# Altium project led_heart.PrjPCB
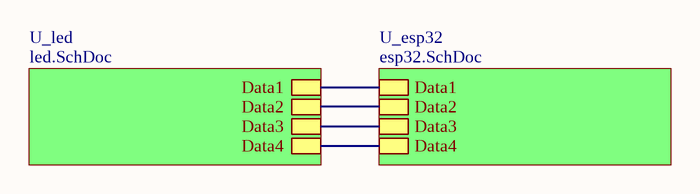
[diagram p0: sche.SchDoc]
3 sheets, 105 parts. Net scope: hierarchical (ports join the sheet entries above them; power ports are global).
Board file: PCB_led_hearrt.PcbDoc
Sheets:
  sche.SchDoc
    U_esp32 = esp32.SchDoc
    U_led = led.SchDoc

## Sheet sche.SchDoc
size A

### Sub-sheets
U_esp32 = esp32.SchDoc: Data1, Data2, Data3, Data4
U_led = led.SchDoc: Data1, Data2, Data3, Data4

### Nets
NetU1_8: sheet U_esp32/Data4, sheet U_led/Data4
NetU1_10: sheet U_esp32/Data3, sheet U_led/Data3
NetU1_11: sheet U_esp32/Data2, sheet U_led/Data2
NetU1_12: sheet U_esp32/Data1, sheet U_led/Data1

## Sheet esp32.SchDoc
size A4
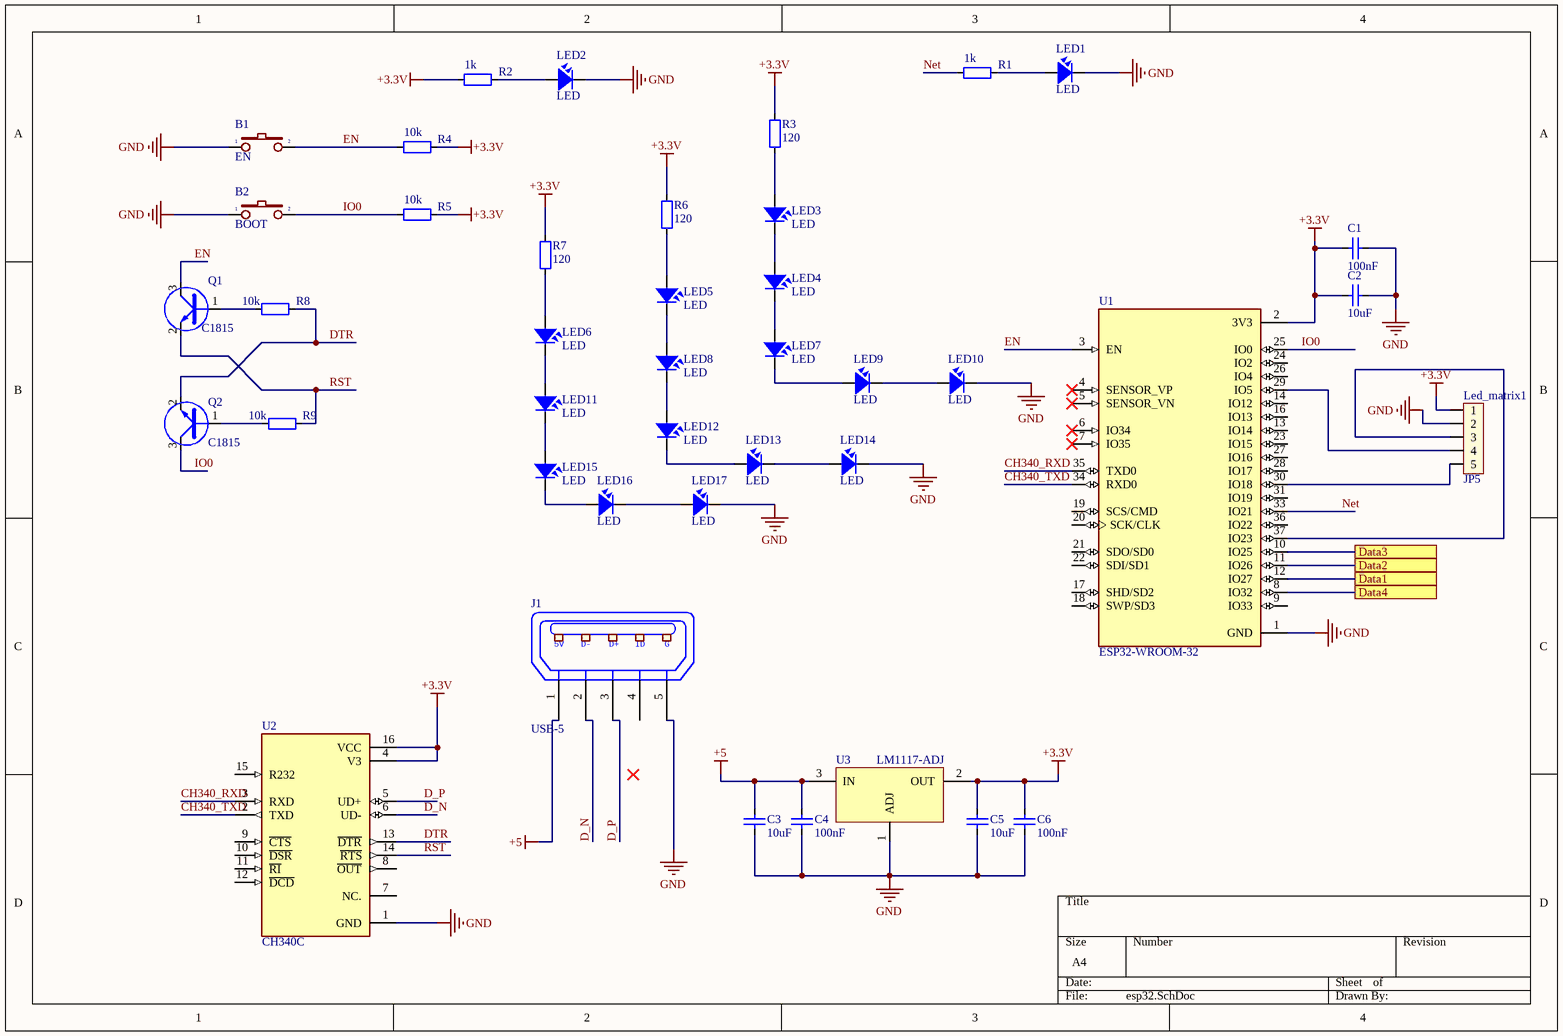
[diagram p1: esp32.SchDoc]

### Parts
B1  EN  [BUTTON_2_SMD]
B2  BOOT  [BUTTON_2_SMD]
C1  100nF  [CAP_0805]
C2  10uF  [CAP_0805]
C3  10uF  [CAP_0805]
C4  100nF  [CAP_0805]
C5  10uF  [CAP_0805]
C6  100nF  [CAP_0805]
J1  USB-5  [USB-M1]
LED1  LED  [LED-0805-Red]
LED2  LED  [LED-0805-Red]
LED3  LED  [LED-0805-Red]
LED4  LED  [LED-0805-Red]
LED5  LED  [LED-0805-Red]
LED6  LED  [LED-0805-Red]
LED7  LED  [LED-0805-Red]
LED8  LED  [LED-0805-Red]
LED9  LED  [LED-0805-Red]
LED10  LED  [LED-0805-Red]
LED11  LED  [LED-0805-Red]
LED12  LED  [LED-0805-Red]
LED13  LED  [LED-0805-Red]
LED14  LED  [LED-0805-Red]
LED15  LED  [LED-0805-Red]
LED16  LED  [LED-0805-Red]
LED17  LED  [LED-0805-Red]
Led_matrix1  JP5  [JP5H]
Q1  C1815  [SOT23]
Q2  C1815  [SOT23]
R1  1k  [RES-SMD-0805]
R2  1k  [RES-SMD-0805]
R3  120  [RES-SMD-0805]
R4  10k  [RES-SMD-0805]
R5  10k  [RES-SMD-0805]
R6  120  [RES-SMD-0805]
R7  120  [RES-SMD-0805]
R8  10k  [RES-SMD-0805]
R9  10k  [RES-SMD-0805]
U1  ESP32-WROOM-32  [ESP32_WROOM32E]
U2  CH340C  [SOIC127P600X180-16N]
U3  LM1117-ADJ  [LM1117-SOP]

### Ports
Data1, Data2, Data3, Data4

### Nets
+3.3V: C1.1 C2.1 C5.1 C6.1 Led_matrix1.1 R2.2 R3.1 R4.1 R5.1 R6.1 R7.1 U1.2(3V3) U2.4(V3) U2.16(VCC) U3.2(OUT)
+5: C3.1 C4.1 J1.1(P1) U3.3(IN)
GND: B1.1 B2.1 C1.2 C2.2 C3.2 C4.2 C5.2 C6.2 J1.5(P5) LED1.2 LED2.2 LED10.2 LED14.2 LED17.2 Led_matrix1.2 U1.1(GND) U2.1(GND) U3.1(ADJ)
CH340_RXD: U1.35(TXD0) U2.3(RXD)
CH340_TXD: U1.34(RXD0) U2.2(TXD)
D_N: J1.2(P2) U2.6(UD-)
D_P: J1.3(P3) U2.5(UD+)
DTR: Q2.2(E) R8.1 U2.13(~{DTR})
EN: B1.2 Q1.3(C) R4.2 U1.3(EN)
IO0: B2.2 Q2.3(C) R5.2 U1.25(IO0)
Net: R1.2 U1.33(IO21)
RST: Q1.2(E) R9.1 U2.14(~{RTS})
NetLED1_1: LED1.1 R1.1
NetLED2_1: LED2.1 R2.1
NetLED3_1: LED3.1 R3.2
NetLED3_2: LED3.2 LED4.1
NetLED4_2: LED4.2 LED7.1
NetLED5_1: LED5.1 R6.2
NetLED5_2: LED5.2 LED8.1
NetLED6_1: LED6.1 R7.2
NetLED6_2: LED6.2 LED11.1
NetLED7_2: LED7.2 LED9.1
NetLED8_2: LED8.2 LED12.1
NetLED9_2: LED9.2 LED10.1
NetLED11_2: LED11.2 LED15.1
NetLED12_2: LED12.2 LED13.1
NetLED13_2: LED13.2 LED14.1
NetLED15_2: LED15.2 LED16.1
NetLED16_2: LED16.2 LED17.1
NetLed_matrix1_3: Led_matrix1.3 U1.37(IO23)
NetLed_matrix1_4: Led_matrix1.4 U1.29(IO5)
NetLed_matrix1_5: Led_matrix1.5 U1.30(IO18)
NetQ1_1: Q1.1(B) R8.2
NetQ2_1: Q2.1(B) R9.2
NetU1_8: U1.8(IO32) ; port Data4
NetU1_10: U1.10(IO25) ; port Data3
NetU1_11: U1.11(IO26) ; port Data2
NetU1_12: U1.12(IO27) ; port Data1

Not connected (* = marked no-connect by the designer): J1 4(P4); U1 4(SENSOR_VP)* 5(SENSOR_VN)* 6(IO34)* 7(IO35)* 9(IO33) 13(IO14) 14(IO12) 16(IO13) 17(SHD/SD2) 18(SWP/SD3) 19(SCS/CMD) 20(SCK/CLK) 21(SDO/SD0) 22(SDI/SD1) 23(IO15) 24(IO2) 26(IO4) 27(IO16) 28(IO17) 31(IO19) 36(IO22); U2 7(NC.) 8(~{OUT}) 9(~{CTS}) 10(~{DSR}) 11(~{RI}) 12(~{DCD}) 15(R232)

### Notes on the sheet
- (in symbol USB-5) 5V; D-; D+; ID; G

### Library data of the parts
B1 B2 = Button 3x4x2.5
C1-C6 = CapSMD: Capacitor; Value: 33p; Published: 8-Jun-2000; LatestRevisionDate: 17-Jul-2002; LatestRevisionNote: Re-released for DXP Platform.; PackageReference: RAD-0.3; Publisher: Altium Limited
J1 = USB-5: Manufacturer: FCI; Manufacturer Part Number: 10118193-0001LF; Connector Type: USB - micro B; Number of Contacts: 5; Gender: Receptacle; Specifications: USB 2.0; .Creator: MM; .Checked PCB: RF; Supplier 1: Digi-Key; RoHS: RoHS Compliant; Category: Connectors, Interconnects; Stock 1: 28642; Pricing 1: 1=0.46, 10=0.433, 25=0.3712, 50=0.3156, 100=0.3032, 250=0.27224, 500=0.25988 (USD); Packaging: Cut Tape (CT); Mounting Type: Surface Mount, Right Angle, Horizontal; Features: Shielded, Solder Retention; Ingress Protection: -; ComponentLink1URL: http://portal.fciconnect.com/Comergent//fci/drawing/10118193.pdf; ComponentLink1Description: http://portal.fciconnect.com/Comergent//fci/drawing/10118193.pdf; Supplier Part Number 1: 609-4616-1-ND; .Checked SCH: MM
LED1-LED17 = LED: LED Single colour Green and Red; Value: LED 3 ly Single Colour
Q1 Q2 = 2SC1815: NPN 600mW, ECB; Value: C1815
R1-R9 = Resistor - SMD: Resistor; Manufacturer: Generic Components; Class: Passive; Published: 08/06/2000; Publisher: Altium Hobart Technology Centre
U1 = ESP32-WROOM-32: Bluetooth, WiFi Transceiver Module 2.4GHz ~ 2.5GHz Surface Mount; MF: Espressif Systems; Package: Module Espressif Systems; Digi-Key_Part_Number: 1904-1010-1-ND; Digi-Key_Purchase_URL: https://www.digikey.com/product-detail/en/espressif-systems/ESP32-WROOM-32/1904-1010-1-ND/8544305?utm_source=snapeda&utm_medium=aggregator&utm_campaign=symbol; Value: *; MP: ESP32-WROOM-32; SnapEDA_Link: https://www.snapeda.com/parts/ESP32-WROOM-32/Espressif%20Systems/view-part/2753322/?ref=snap
U2 = CH340C: USB to serial chip CH340; MF: WCH; Price: None; Availability: Not in stock; MP: CH340C; Package: None; SnapEDA_Link: https://www.snapeda.com/parts/CH340C/WCH/view-part/?ref=snap; Check_prices: https://www.snapeda.com/parts/CH340C/WCH/view-part/?ref=eda; Value: *
U3 = LM1117-ADJ: 800mA Low-Dropout Linear Regulator; Creator: Nguyen Ba Bien; Website: http://group3i.net

## Sheet led.SchDoc
size A3
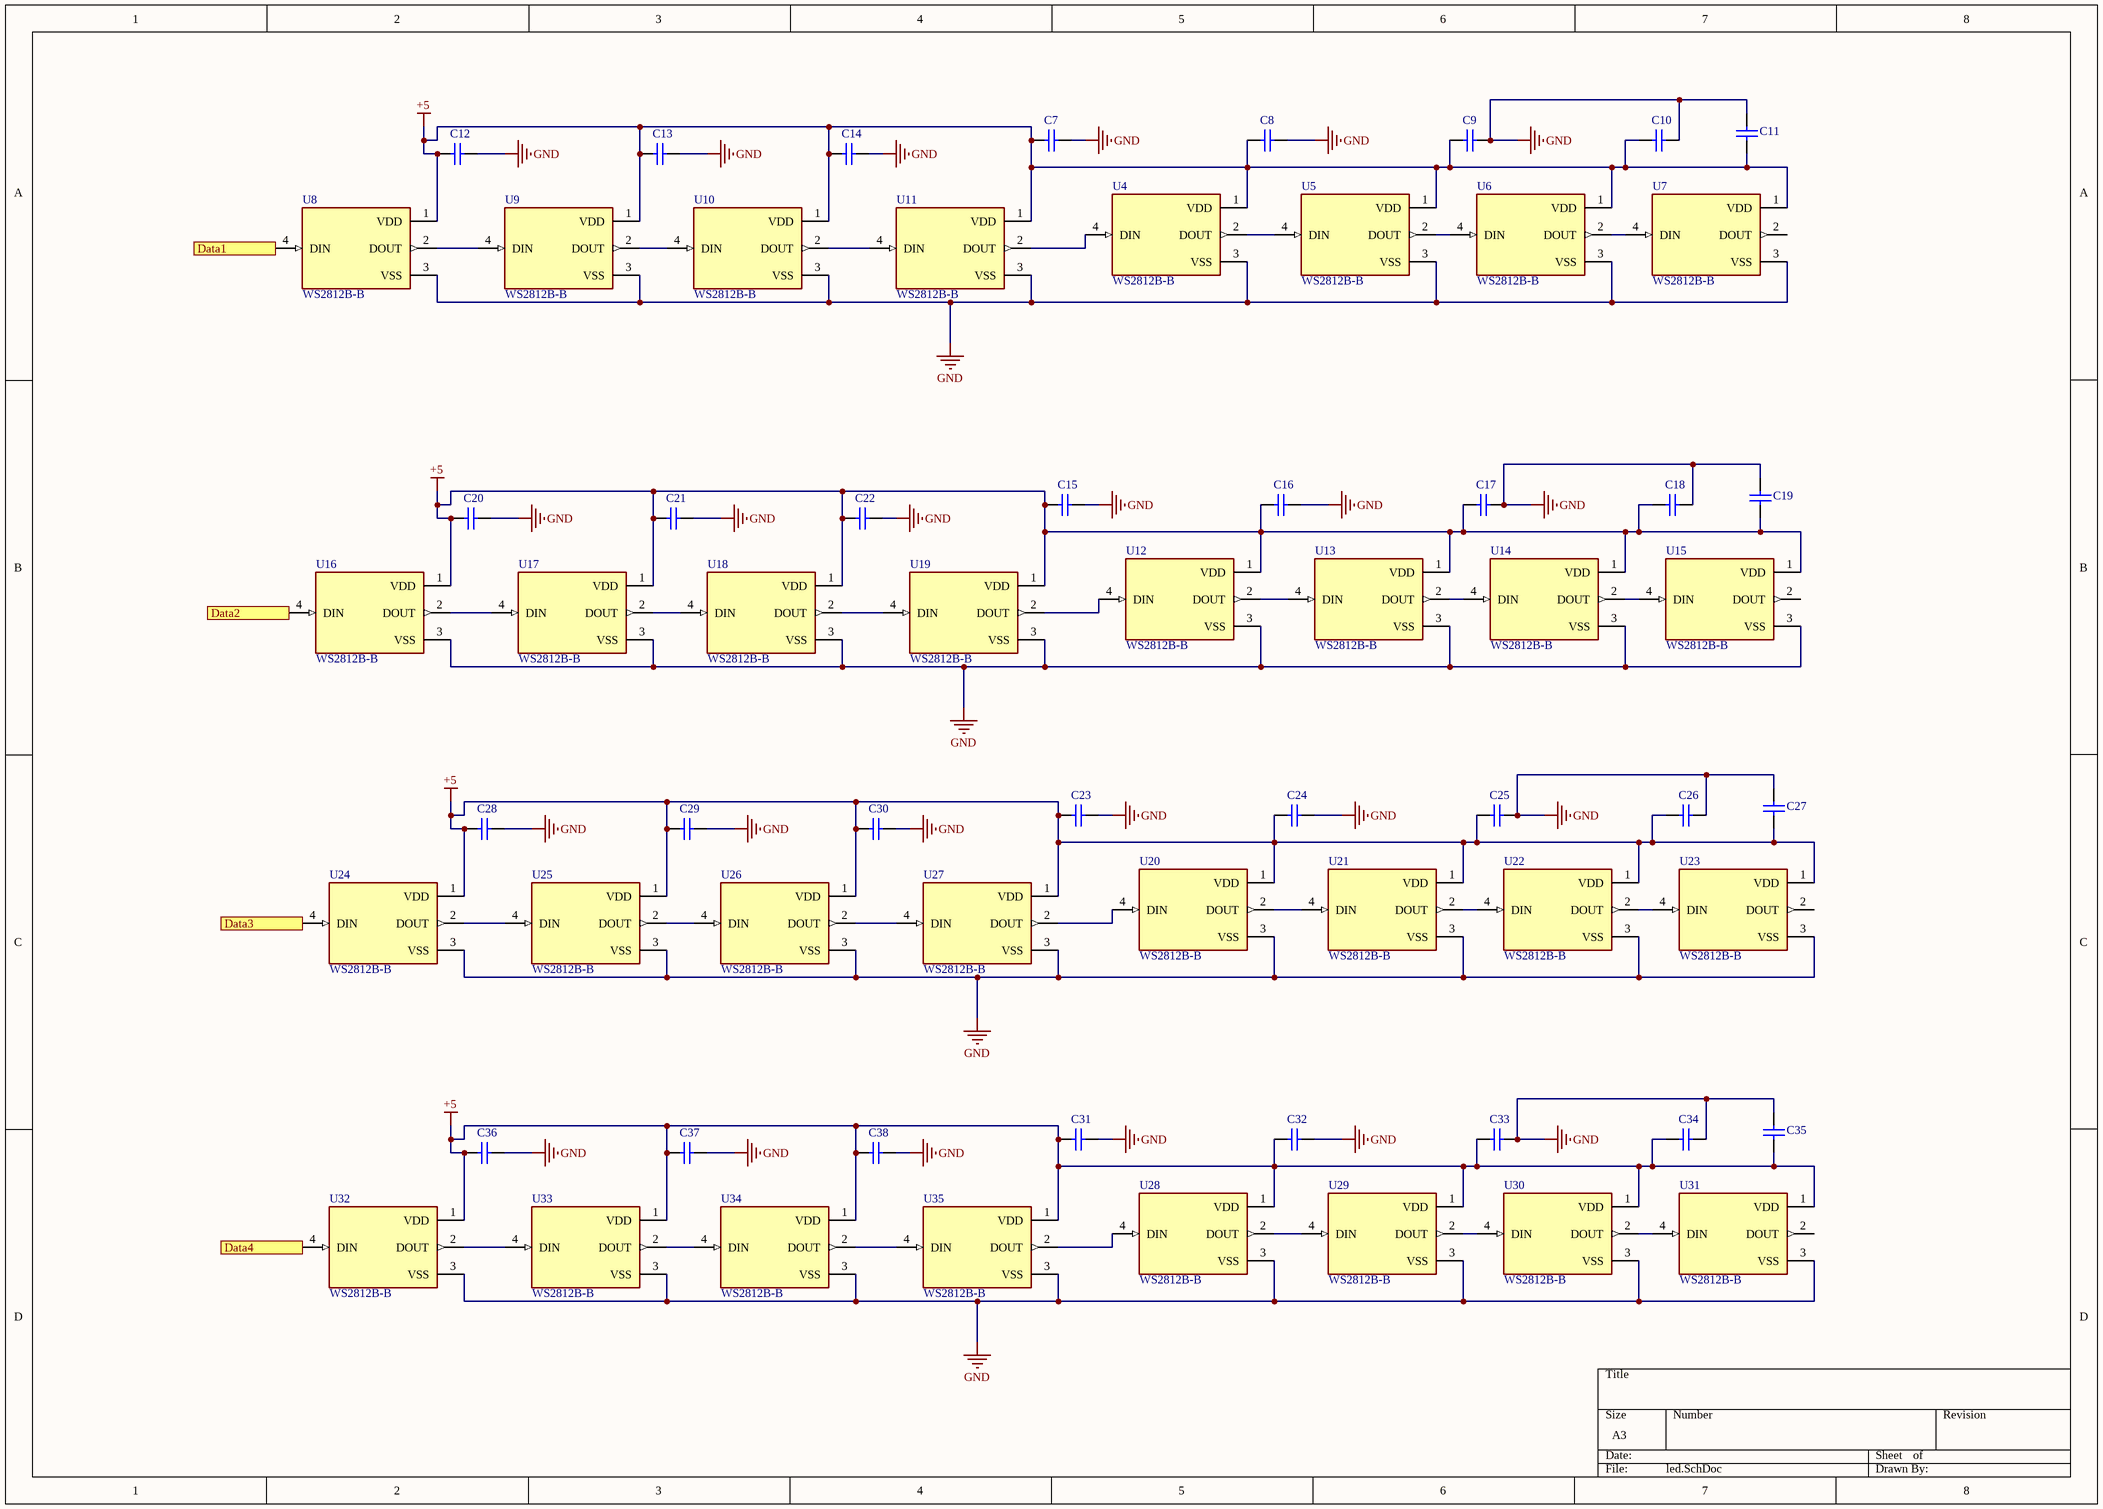
[diagram p2: led.SchDoc]

### Parts
C7  Capacitor Ceramic  [C0805]  (value not drawn)
C8  Capacitor Ceramic  [C0805]  (value not drawn)
C9  Capacitor Ceramic  [C0805]  (value not drawn)
C10  Capacitor Ceramic  [C0805]  (value not drawn)
C11  Capacitor Ceramic  [C0805]  (value not drawn)
C12  Capacitor Ceramic  [C0805]  (value not drawn)
C13  Capacitor Ceramic  [C0805]  (value not drawn)
C14  Capacitor Ceramic  [C0805]  (value not drawn)
C15  Capacitor Ceramic  [C0805]  (value not drawn)
C16  Capacitor Ceramic  [C0805]  (value not drawn)
C17  Capacitor Ceramic  [C0805]  (value not drawn)
C18  Capacitor Ceramic  [C0805]  (value not drawn)
C19  Capacitor Ceramic  [C0805]  (value not drawn)
C20  Capacitor Ceramic  [C0805]  (value not drawn)
C21  Capacitor Ceramic  [C0805]  (value not drawn)
C22  Capacitor Ceramic  [C0805]  (value not drawn)
C23  Capacitor Ceramic  [C0805]  (value not drawn)
C24  Capacitor Ceramic  [C0805]  (value not drawn)
C25  Capacitor Ceramic  [C0805]  (value not drawn)
C26  Capacitor Ceramic  [C0805]  (value not drawn)
C27  Capacitor Ceramic  [C0805]  (value not drawn)
C28  Capacitor Ceramic  [C0805]  (value not drawn)
C29  Capacitor Ceramic  [C0805]  (value not drawn)
C30  Capacitor Ceramic  [C0805]  (value not drawn)
C31  Capacitor Ceramic  [C0805]  (value not drawn)
C32  Capacitor Ceramic  [C0805]  (value not drawn)
C33  Capacitor Ceramic  [C0805]  (value not drawn)
C34  Capacitor Ceramic  [C0805]  (value not drawn)
C35  Capacitor Ceramic  [C0805]  (value not drawn)
C36  Capacitor Ceramic  [C0805]  (value not drawn)
C37  Capacitor Ceramic  [C0805]  (value not drawn)
C38  Capacitor Ceramic  [C0805]  (value not drawn)
U4  WS2812B-B  [LED_WS2812B-B]
U5  WS2812B-B  [LED_WS2812B-B]
U6  WS2812B-B  [LED_WS2812B-B]
U7  WS2812B-B  [LED_WS2812B-B]
U8  WS2812B-B  [LED_WS2812B-B]
U9  WS2812B-B  [LED_WS2812B-B]
U10  WS2812B-B  [LED_WS2812B-B]
U11  WS2812B-B  [LED_WS2812B-B]
U12  WS2812B-B  [LED_WS2812B-B]
U13  WS2812B-B  [LED_WS2812B-B]
U14  WS2812B-B  [LED_WS2812B-B]
U15  WS2812B-B  [LED_WS2812B-B]
U16  WS2812B-B  [LED_WS2812B-B]
U17  WS2812B-B  [LED_WS2812B-B]
U18  WS2812B-B  [LED_WS2812B-B]
U19  WS2812B-B  [LED_WS2812B-B]
U20  WS2812B-B  [LED_WS2812B-B]
U21  WS2812B-B  [LED_WS2812B-B]
U22  WS2812B-B  [LED_WS2812B-B]
U23  WS2812B-B  [LED_WS2812B-B]
U24  WS2812B-B  [LED_WS2812B-B]
U25  WS2812B-B  [LED_WS2812B-B]
U26  WS2812B-B  [LED_WS2812B-B]
U27  WS2812B-B  [LED_WS2812B-B]
U28  WS2812B-B  [LED_WS2812B-B]
U29  WS2812B-B  [LED_WS2812B-B]
U30  WS2812B-B  [LED_WS2812B-B]
U31  WS2812B-B  [LED_WS2812B-B]
U32  WS2812B-B  [LED_WS2812B-B]
U33  WS2812B-B  [LED_WS2812B-B]
U34  WS2812B-B  [LED_WS2812B-B]
U35  WS2812B-B  [LED_WS2812B-B]

### Ports
Data1, Data2, Data3, Data4

### Nets
+5: C7.1 C8.1 C9.1 C10.1 C11.1 C12.1 C13.1 C14.1 C15.1 C16.1 C17.1 C18.1 C19.1 C20.1 C21.1 C22.1 C23.1 C24.1 C25.1 C26.1 C27.1 C28.1 C29.1 C30.1 C31.1 C32.1 C33.1 C34.1 C35.1 C36.1 C37.1 C38.1 U4.1(VDD) U5.1(VDD) U6.1(VDD) U7.1(VDD) U8.1(VDD) U9.1(VDD) U10.1(VDD) U11.1(VDD) U12.1(VDD) U13.1(VDD) U14.1(VDD) U15.1(VDD) U16.1(VDD) U17.1(VDD) U18.1(VDD) U19.1(VDD) U20.1(VDD) U21.1(VDD) U22.1(VDD) U23.1(VDD) U24.1(VDD) U25.1(VDD) U26.1(VDD) U27.1(VDD) U28.1(VDD) U29.1(VDD) U30.1(VDD) U31.1(VDD) U32.1(VDD) U33.1(VDD) U34.1(VDD) U35.1(VDD)
GND: C7.2 C8.2 C9.2 C10.2 C11.2 C12.2 C13.2 C14.2 C15.2 C16.2 C17.2 C18.2 C19.2 C20.2 C21.2 C22.2 C23.2 C24.2 C25.2 C26.2 C27.2 C28.2 C29.2 C30.2 C31.2 C32.2 C33.2 C34.2 C35.2 C36.2 C37.2 C38.2 U4.3(VSS) U5.3(VSS) U6.3(VSS) U7.3(VSS) U8.3(VSS) U9.3(VSS) U10.3(VSS) U11.3(VSS) U12.3(VSS) U13.3(VSS) U14.3(VSS) U15.3(VSS) U16.3(VSS) U17.3(VSS) U18.3(VSS) U19.3(VSS) U20.3(VSS) U21.3(VSS) U22.3(VSS) U23.3(VSS) U24.3(VSS) U25.3(VSS) U26.3(VSS) U27.3(VSS) U28.3(VSS) U29.3(VSS) U30.3(VSS) U31.3(VSS) U32.3(VSS) U33.3(VSS) U34.3(VSS) U35.3(VSS)
NetU1_8: U32.4(DIN) ; port Data4
NetU1_10: U24.4(DIN) ; port Data3
NetU1_11: U16.4(DIN) ; port Data2
NetU1_12: U8.4(DIN) ; port Data1
NetU4_2: U4.2(DOUT) U5.4(DIN)
NetU4_4: U4.4(DIN) U11.2(DOUT)
NetU5_2: U5.2(DOUT) U6.4(DIN)
NetU6_2: U6.2(DOUT) U7.4(DIN)
NetU8_2: U8.2(DOUT) U9.4(DIN)
NetU9_2: U9.2(DOUT) U10.4(DIN)
NetU10_2: U10.2(DOUT) U11.4(DIN)
NetU12_2: U12.2(DOUT) U13.4(DIN)
NetU12_4: U12.4(DIN) U19.2(DOUT)
NetU13_2: U13.2(DOUT) U14.4(DIN)
NetU14_2: U14.2(DOUT) U15.4(DIN)
NetU16_2: U16.2(DOUT) U17.4(DIN)
NetU17_2: U17.2(DOUT) U18.4(DIN)
NetU18_2: U18.2(DOUT) U19.4(DIN)
NetU20_2: U20.2(DOUT) U21.4(DIN)
NetU20_4: U20.4(DIN) U27.2(DOUT)
NetU21_2: U21.2(DOUT) U22.4(DIN)
NetU22_2: U22.2(DOUT) U23.4(DIN)
NetU24_2: U24.2(DOUT) U25.4(DIN)
NetU25_2: U25.2(DOUT) U26.4(DIN)
NetU26_2: U26.2(DOUT) U27.4(DIN)
NetU28_2: U28.2(DOUT) U29.4(DIN)
NetU28_4: U28.4(DIN) U35.2(DOUT)
NetU29_2: U29.2(DOUT) U30.4(DIN)
NetU30_2: U30.2(DOUT) U31.4(DIN)
NetU32_2: U32.2(DOUT) U33.4(DIN)
NetU33_2: U33.2(DOUT) U34.4(DIN)
NetU34_2: U34.2(DOUT) U35.4(DIN)

Not connected (* = marked no-connect by the designer): U7 2(DOUT); U15 2(DOUT); U23 2(DOUT); U31 2(DOUT)

### Library data of the parts
C7-C38 = CapSMD: Capacitor; Value: 33p; Published: 8-Jun-2000; LatestRevisionDate: 17-Jul-2002; LatestRevisionNote: Re-released for DXP Platform.; PackageReference: RAD-0.3; Publisher: Altium Limited
U4-U35 = WS2812B-B: Intelligent control LED integrated light source; Availability: Unavailable; Price: None; Package: None; MP: WS2812B-B; Value: *

## Nets that join several sheets
+5: esp32 (C3.1 C4.1 J1.1 U3.3), led (64 pins)
GND: esp32 (18 pins), led (64 pins)
NetU1_8: esp32 (U1.8), led (U32.4)
NetU1_10: esp32 (U1.10), led (U24.4)
NetU1_11: esp32 (U1.11), led (U16.4)
NetU1_12: esp32 (U1.12), led (U8.4)